# Altium schematic sheet FourKeysKeyboard.SchDoc
size A4
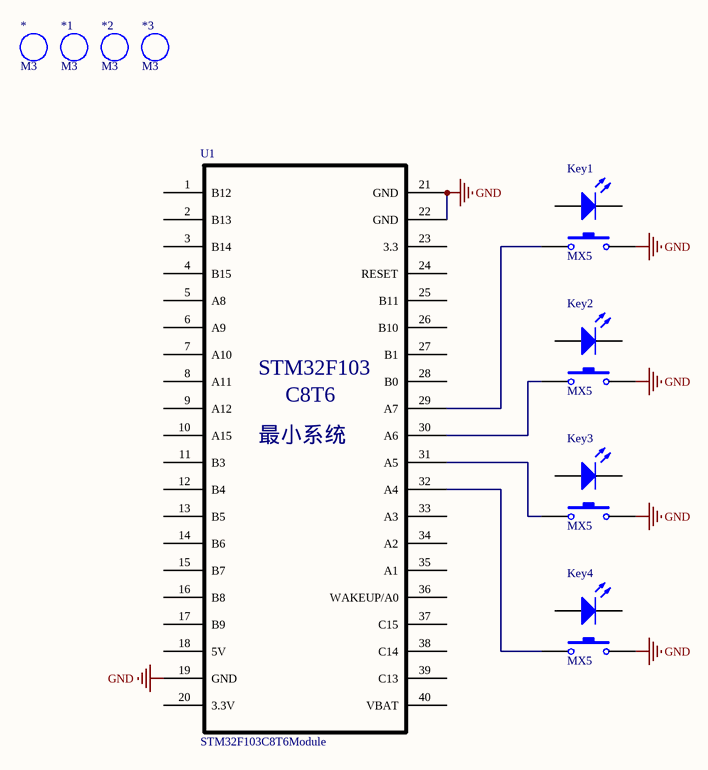
[diagram p0: FourKeysKeyboard.SchDoc]

## Parts
*  M3  [M3 125X200]
*1  M3  [M3 125X200]
*2  M3  [M3 125X200]
*3  M3  [M3 125X200]
Key1  MX5  [LSW DIP-CHERRY]
Key2  MX5  [LSW DIP-CHERRY]
Key3  MX5  [LSW DIP-CHERRY]
Key4  MX5  [LSW DIP-CHERRY]
U1  STM32F103C8T6Module  [STM32F103C8T6_Module]

## Nets
GND: Key1.2 Key2.2 Key3.2 Key4.2 U1.19(GND) U1.21(GND) U1.22(GND)
NetKey1_1: Key1.1 U1.29(A7)
NetKey2_1: Key2.1 U1.30(A6)
NetKey3_1: Key3.1 U1.31(A5)
NetKey4_1: Key4.1 U1.32(A4)

Not connected (* = marked no-connect by the designer): Key1 A K; Key2 A K; Key3 A K; Key4 A K; U1 1(B12) 2(B13) 3(B14) 4(B15) 5(A8) 6(A9) 7(A10) 8(A11) 9(A12) 10(A15) 11(B3) 12(B4) 13(B5) 14(B6) 15(B7) 16(B8) 17(B9) 18(5V) 20(3.3V) 23(3.3) 24(RESET) 25(B11) 26(B10) 27(B1) 28(B0) 33(A3) 34(A2) 35(A1) 36(WAKEUP/A0) 37(C15) 38(C14) 39(C13) 40(VBAT)

## Notes on the sheet
- (in symbol STM32F103C8T6Module) STM32F103; C8T6; 最小系统

## Library data of the parts
* *1-*3 = M3: 铜柱孔; 版权归属: 源创客; BOM名称: 铜柱孔; 学习资源: www.ooocke.com
Key1-Key4 = Cherry_Key_withLED